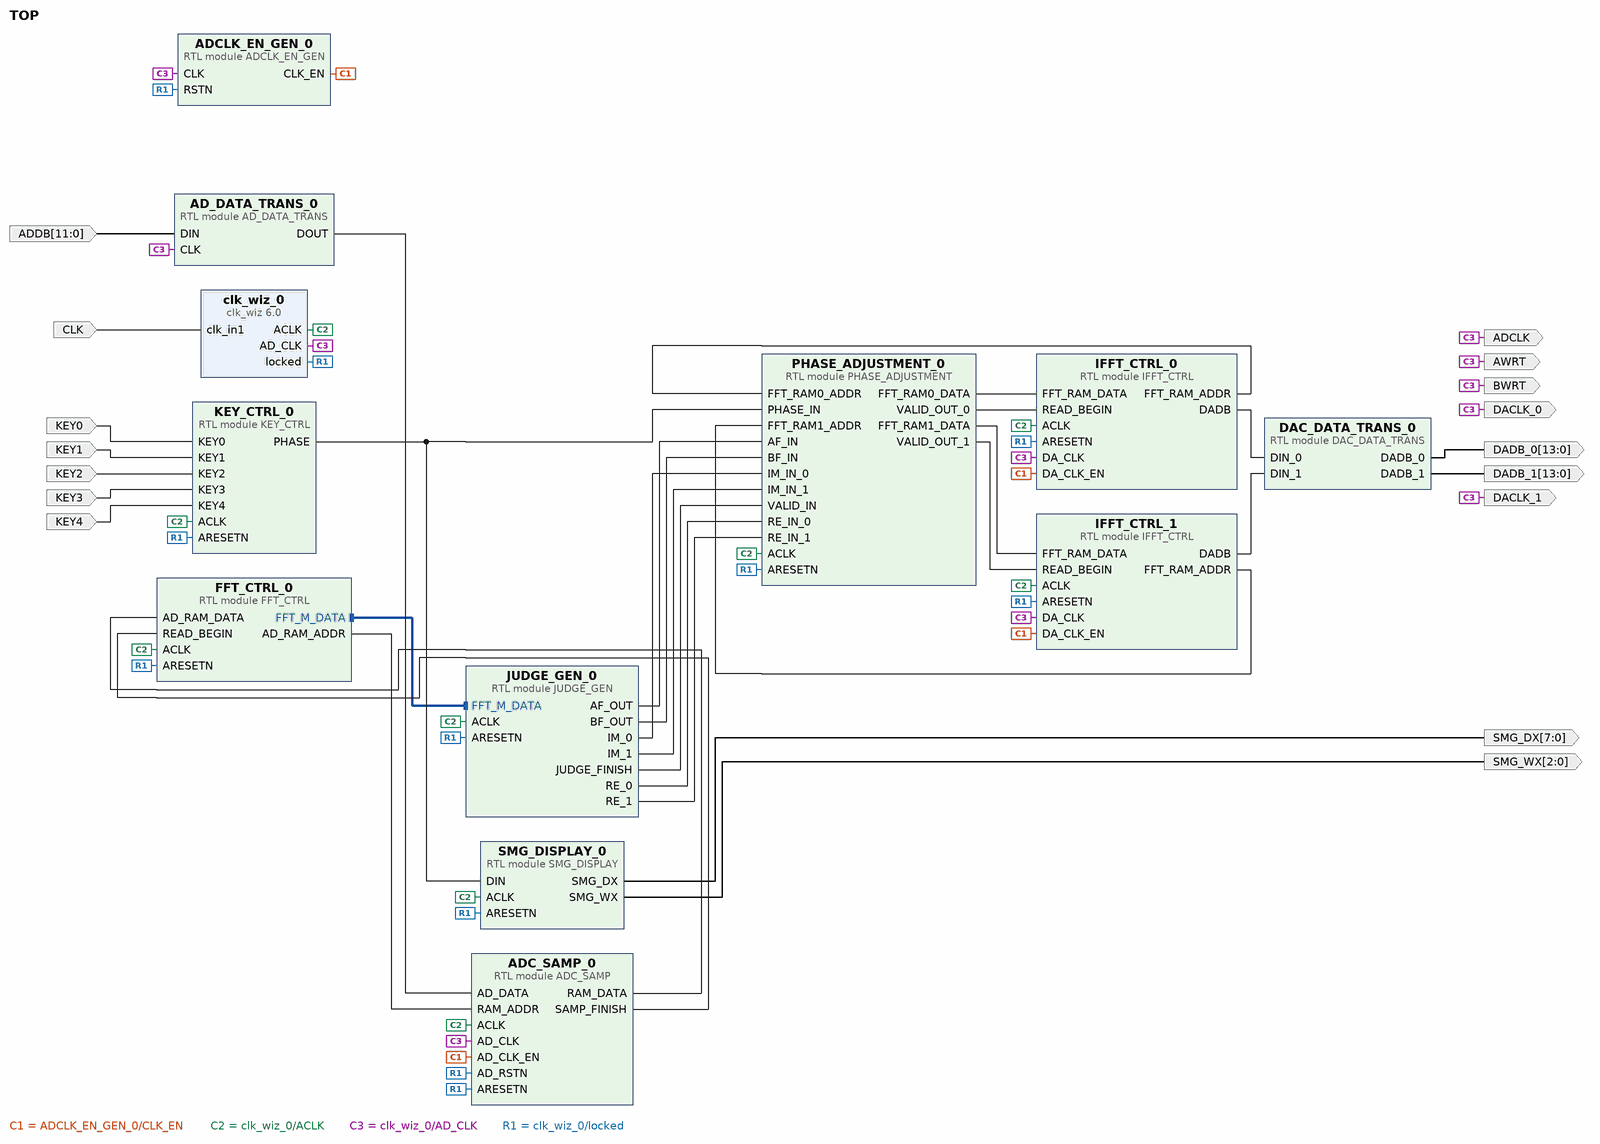
[diagram p0: block diagram of the top level]
# Vivado block design TOP, xc7a35tfgg484-2, Vivado 2022.2
create_bd_design TOP

create_bd_port -dir I -type clk CLK
set_property -dict {CONFIG.FREQ_HZ 50000000} [get_bd_ports CLK]
create_bd_port -dir I -from 11 -to 0 ADDB
create_bd_port -dir O -from 13 -to 0 DADB_0
create_bd_port -dir O -from 13 -to 0 DADB_1
create_bd_port -dir O -type clk DACLK_0
create_bd_port -dir O DACLK_1
create_bd_port -dir O AWRT
create_bd_port -dir O BWRT
create_bd_port -dir O -type clk ADCLK
create_bd_port -dir I KEY0
create_bd_port -dir I KEY1
create_bd_port -dir I KEY2
create_bd_port -dir I KEY3
create_bd_port -dir I KEY4
create_bd_port -dir O -from 2 -to 0 SMG_WX
create_bd_port -dir O -from 7 -to 0 SMG_DX

create_bd_cell -type module -reference ADC_SAMP ADC_SAMP_0
create_bd_cell -type module -reference FFT_CTRL FFT_CTRL_0
create_bd_cell -type ip -vlnv xilinx.com:ip:clk_wiz:6.0 clk_wiz_0
set_property -dict [list \
  CONFIG.CLKIN1_JITTER_PS 200.0 \
  CONFIG.CLKOUT1_JITTER 308.325 \
  CONFIG.CLKOUT1_PHASE_ERROR 144.334 \
  CONFIG.CLKOUT1_REQUESTED_OUT_FREQ 10.24 \
  CONFIG.CLKOUT2_JITTER 186.330 \
  CONFIG.CLKOUT2_PHASE_ERROR 144.334 \
  CONFIG.CLKOUT2_USED true \
  CONFIG.CLK_OUT1_PORT AD_CLK \
  CONFIG.CLK_OUT2_PORT ACLK \
  CONFIG.ENABLE_CLOCK_MONITOR false \
  CONFIG.MMCM_CLKFBOUT_MULT_F 16.000 \
  CONFIG.MMCM_CLKIN1_PERIOD 20.000 \
  CONFIG.MMCM_CLKIN2_PERIOD 10.0 \
  CONFIG.MMCM_CLKOUT0_DIVIDE_F 78.125 \
  CONFIG.MMCM_CLKOUT1_DIVIDE 8 \
  CONFIG.NUM_OUT_CLKS 2 \
  CONFIG.PRIMITIVE MMCM \
  CONFIG.PRIM_IN_FREQ 50 \
  CONFIG.USE_LOCKED true \
  CONFIG.USE_RESET false \
] [get_bd_cells clk_wiz_0]
create_bd_cell -type module -reference ADCLK_EN_GEN ADCLK_EN_GEN_0
create_bd_cell -type module -reference AD_DATA_TRANS AD_DATA_TRANS_0
create_bd_cell -type module -reference JUDGE_GEN JUDGE_GEN_0
set_property -dict {CONFIG.VALUE_LIMIT 0} [get_bd_cells JUDGE_GEN_0]
create_bd_cell -type module -reference DAC_DATA_TRANS DAC_DATA_TRANS_0
create_bd_cell -type module -reference KEY_CTRL KEY_CTRL_0
create_bd_cell -type module -reference SMG_DISPLAY SMG_DISPLAY_0
create_bd_cell -type module -reference IFFT_CTRL IFFT_CTRL_0
create_bd_cell -type module -reference IFFT_CTRL IFFT_CTRL_1
create_bd_cell -type module -reference PHASE_ADJUSTMENT PHASE_ADJUSTMENT_0

# ---- connections ----

connect_bd_intf_net [get_bd_intf_pins FFT_CTRL_0/FFT_M_DATA] [get_bd_intf_pins JUDGE_GEN_0/FFT_M_DATA]
connect_bd_net [get_bd_pins ADCLK_EN_GEN_0/CLK_EN] \
  [get_bd_pins ADC_SAMP_0/AD_CLK_EN] [get_bd_pins IFFT_CTRL_0/DA_CLK_EN] [get_bd_pins IFFT_CTRL_1/DA_CLK_EN]
connect_bd_net [get_bd_pins ADC_SAMP_0/RAM_DATA] [get_bd_pins FFT_CTRL_0/AD_RAM_DATA]
connect_bd_net [get_bd_pins ADC_SAMP_0/SAMP_FINISH] [get_bd_pins FFT_CTRL_0/READ_BEGIN]
connect_bd_net [get_bd_pins AD_DATA_TRANS_0/DOUT] [get_bd_pins ADC_SAMP_0/AD_DATA]
connect_bd_net [get_bd_pins DAC_DATA_TRANS_0/DADB_0] [get_bd_ports DADB_0]
connect_bd_net [get_bd_pins DAC_DATA_TRANS_0/DADB_1] [get_bd_ports DADB_1]
connect_bd_net -net DIN_0_1 [get_bd_ports ADDB] [get_bd_pins AD_DATA_TRANS_0/DIN]
connect_bd_net [get_bd_pins FFT_CTRL_0/AD_RAM_ADDR] [get_bd_pins ADC_SAMP_0/RAM_ADDR]
connect_bd_net [get_bd_pins IFFT_CTRL_0/DADB] [get_bd_pins DAC_DATA_TRANS_0/DIN_0]
connect_bd_net [get_bd_pins IFFT_CTRL_0/FFT_RAM_ADDR] [get_bd_pins PHASE_ADJUSTMENT_0/FFT_RAM0_ADDR]
connect_bd_net [get_bd_pins IFFT_CTRL_1/DADB] [get_bd_pins DAC_DATA_TRANS_0/DIN_1]
connect_bd_net [get_bd_pins IFFT_CTRL_1/FFT_RAM_ADDR] [get_bd_pins PHASE_ADJUSTMENT_0/FFT_RAM1_ADDR]
connect_bd_net [get_bd_pins JUDGE_GEN_0/AF_OUT] [get_bd_pins PHASE_ADJUSTMENT_0/AF_IN]
connect_bd_net [get_bd_pins JUDGE_GEN_0/BF_OUT] [get_bd_pins PHASE_ADJUSTMENT_0/BF_IN]
connect_bd_net [get_bd_pins JUDGE_GEN_0/IM_0] [get_bd_pins PHASE_ADJUSTMENT_0/IM_IN_0]
connect_bd_net [get_bd_pins JUDGE_GEN_0/IM_1] [get_bd_pins PHASE_ADJUSTMENT_0/IM_IN_1]
connect_bd_net [get_bd_pins JUDGE_GEN_0/JUDGE_FINISH] [get_bd_pins PHASE_ADJUSTMENT_0/VALID_IN]
connect_bd_net [get_bd_pins JUDGE_GEN_0/RE_0] [get_bd_pins PHASE_ADJUSTMENT_0/RE_IN_0]
connect_bd_net [get_bd_pins JUDGE_GEN_0/RE_1] [get_bd_pins PHASE_ADJUSTMENT_0/RE_IN_1]
connect_bd_net -net KEY0_0_1 [get_bd_ports KEY0] [get_bd_pins KEY_CTRL_0/KEY0]
connect_bd_net -net KEY1_0_1 [get_bd_ports KEY1] [get_bd_pins KEY_CTRL_0/KEY1]
connect_bd_net -net KEY2_0_1 [get_bd_ports KEY2] [get_bd_pins KEY_CTRL_0/KEY2]
connect_bd_net -net KEY3_0_1 [get_bd_ports KEY3] [get_bd_pins KEY_CTRL_0/KEY3]
connect_bd_net -net KEY4_0_1 [get_bd_ports KEY4] [get_bd_pins KEY_CTRL_0/KEY4]
connect_bd_net [get_bd_pins KEY_CTRL_0/PHASE] [get_bd_pins SMG_DISPLAY_0/DIN] [get_bd_pins PHASE_ADJUSTMENT_0/PHASE_IN]
connect_bd_net [get_bd_pins PHASE_ADJUSTMENT_0/FFT_RAM0_DATA] [get_bd_pins IFFT_CTRL_0/FFT_RAM_DATA]
connect_bd_net [get_bd_pins PHASE_ADJUSTMENT_0/FFT_RAM1_DATA] [get_bd_pins IFFT_CTRL_1/FFT_RAM_DATA]
connect_bd_net [get_bd_pins PHASE_ADJUSTMENT_0/VALID_OUT_0] [get_bd_pins IFFT_CTRL_0/READ_BEGIN]
connect_bd_net [get_bd_pins PHASE_ADJUSTMENT_0/VALID_OUT_1] [get_bd_pins IFFT_CTRL_1/READ_BEGIN]
connect_bd_net [get_bd_pins SMG_DISPLAY_0/SMG_DX] [get_bd_ports SMG_DX]
connect_bd_net [get_bd_pins SMG_DISPLAY_0/SMG_WX] [get_bd_ports SMG_WX]
connect_bd_net -net clk_in1_0_1 [get_bd_ports CLK] [get_bd_pins clk_wiz_0/clk_in1]
connect_bd_net [get_bd_pins clk_wiz_0/ACLK] \
  [get_bd_pins ADC_SAMP_0/ACLK] [get_bd_pins FFT_CTRL_0/ACLK] [get_bd_pins JUDGE_GEN_0/ACLK] [get_bd_pins KEY_CTRL_0/ACLK] \
  [get_bd_pins SMG_DISPLAY_0/ACLK] [get_bd_pins IFFT_CTRL_0/ACLK] [get_bd_pins IFFT_CTRL_1/ACLK] \
  [get_bd_pins PHASE_ADJUSTMENT_0/ACLK]
connect_bd_net [get_bd_pins clk_wiz_0/AD_CLK] \
  [get_bd_pins ADC_SAMP_0/AD_CLK] [get_bd_pins ADCLK_EN_GEN_0/CLK] [get_bd_pins AD_DATA_TRANS_0/CLK] [get_bd_ports ADCLK] \
  [get_bd_pins IFFT_CTRL_0/DA_CLK] [get_bd_pins IFFT_CTRL_1/DA_CLK] [get_bd_ports DACLK_1] [get_bd_ports DACLK_0] \
  [get_bd_ports AWRT] [get_bd_ports BWRT]
connect_bd_net [get_bd_pins clk_wiz_0/locked] \
  [get_bd_pins ADC_SAMP_0/AD_RSTN] [get_bd_pins ADC_SAMP_0/ARESETN] [get_bd_pins FFT_CTRL_0/ARESETN] \
  [get_bd_pins ADCLK_EN_GEN_0/RSTN] [get_bd_pins JUDGE_GEN_0/ARESETN] [get_bd_pins KEY_CTRL_0/ARESETN] \
  [get_bd_pins SMG_DISPLAY_0/ARESETN] [get_bd_pins IFFT_CTRL_0/ARESETN] [get_bd_pins IFFT_CTRL_1/ARESETN] \
  [get_bd_pins PHASE_ADJUSTMENT_0/ARESETN]

validate_bd_design
save_bd_design
